# Altium project EPS.PrjPcb (part 4 of 4)

## Sheet EPS_VBAT_EMI-Filter.SchDoc: VBAT / EMI Filter
size A4; Date: 2015-10-11; Author: Piotr Kuligowski; DocumentNumber: PWSat2-xxx-DW-xxx; Revision: 1-0; SheetNumber: 38; SheetTotal: 51; Model: EM1
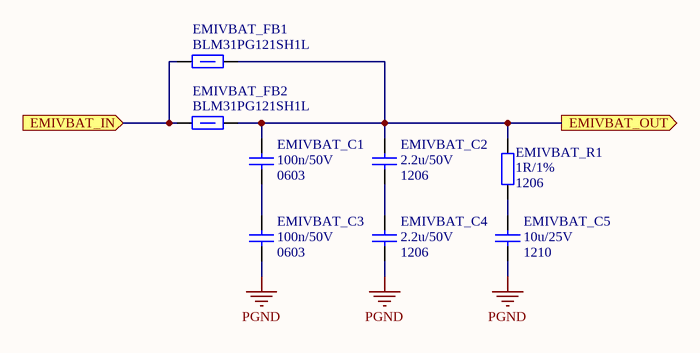
[diagram p36: EPS_VBAT_EMI-Filter.SchDoc]

### Parts
EMIVBAT_C1  Package: 0603  [SMD_Capacitor_0603]  (hidden comment: 100n/50V)
EMIVBAT_C2  Package: 1206  [SMD_Capacitor_1206]  (hidden comment: 2.2u/50V)
EMIVBAT_C3  Package: 0603  [SMD_Capacitor_0603]  (hidden comment: 100n/50V)
EMIVBAT_C4  Package: 1206  [SMD_Capacitor_1206]  (hidden comment: 2.2u/50V)
EMIVBAT_C5  Package: 1210  [SMD_Capacitor_1210]  (hidden comment: 10u/25V)
EMIVBAT_FB1  120R/100MHz  [SMD_FerriteBead_1206]  (value not drawn)
EMIVBAT_FB2  120R/100MHz  [SMD_FerriteBead_1206]  (value not drawn)
EMIVBAT_R1  Package: 1206  [SMD_Resistor_1206]  (hidden comment: 1R/1%)

### Ports
EMIVBAT_IN (in), EMIVBAT_OUT (out)

### Nets
PGND: EMIVBAT_C3.2 EMIVBAT_C4.2 EMIVBAT_C5.2
NetEMIVBAT_C1_1: EMIVBAT_C1.1 EMIVBAT_C2.1 EMIVBAT_FB1.1 EMIVBAT_FB2.1 EMIVBAT_R1.1 ; port EMIVBAT_OUT
NetEMIVBAT_C1_2: EMIVBAT_C1.2 EMIVBAT_C3.1
NetEMIVBAT_C2_2: EMIVBAT_C2.2 EMIVBAT_C4.1
NetEMIVBAT_C5_1: EMIVBAT_C5.1 EMIVBAT_R1.2
NetEMIVBAT_FB1_2: EMIVBAT_FB1.2 EMIVBAT_FB2.2 ; port EMIVBAT_IN

### Notes on the sheet
- Title:
- Project:
- Author:
- Model:
- Document Number:
- Checked by:
- Rev:
- Date:
- Approved by:
- Sheet:
- of
- File name:

### Library data of the parts
EMIVBAT_C1 EMIVBAT_C3 = Cer_C0603T104K5RALTU: Ceramic Cap Kemet COTS 100n/50V X7R 0603; Manufacturer: Kemet; ManufacturerPartNumber: C0603T104K5RALTU; Value: 100n/50V
EMIVBAT_C2 EMIVBAT_C4 = Cer_GCJ31CR71H225KA12L: Ceramic Cap Murata Automotive 2.2u/50V X7R 1206; Manufacturer: Murata; ManufacturerPartNumber: GCJ31CR71H225KA12L; Value: 2.2u/50V
EMIVBAT_C5 = Cer_GCJ32ER71E106KA12L: Ceramic Cap Murata Automotive 10u/25V X7R 1210; Manufacturer: Murata; ManufacturerPartNumber: GCJ32ER71E106KA12L; Value: 10u/25V
EMIVBAT_FB1 EMIVBAT_FB2 = BLM31PG121SH1L: Ferrite bead, 1206, 0.02HM, 3.5A.; Manufacturer: Murata; Current Rating: 3.5A; Series Resistance DC: 0.02R; Package: 1206; Value: 120R/100MHz; ManufacturerPartNumber: BLM31PG121SH1L
EMIVBAT_R1 = CRCW12061R00FKxxxx: 1R/1% Vishay CRCW 1206 Resistor. 250mW, 100ppm, 200V.; ManufacturerPartNumber: CRCW12061R00FKxxxx; Manufacturer: Vishay; Value: 1R/1%

## Sheet EPS_Battery_Controller_Diode.SchDoc: Battery / Controller / Ideal Diode
size A4; ApprovedBy: (not approved); CheckedBy: (not checked); Author: Piotr Kuligowski; DocumentNumber: PWSat2-xxx-DW-xxx; Revision: 2; SheetNumber: 27; SheetTotal: 51; Model: EM2
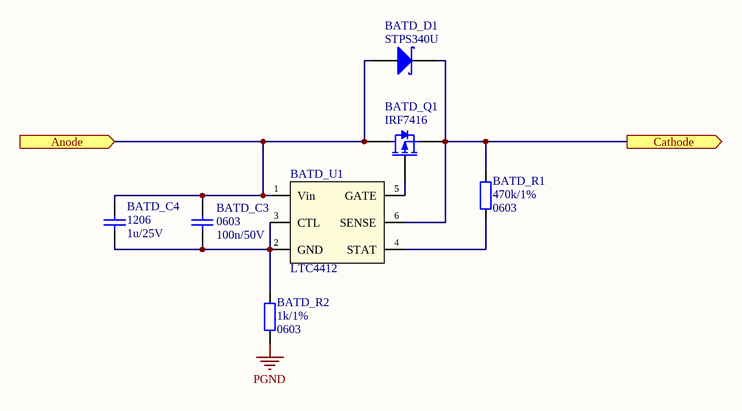
[diagram p37: EPS_Battery_Controller_Diode.SchDoc]

### Parts
BATD_C3  Package: 0603  [SMD_Capacitor_0603]  (hidden comment: 100n/50V)
BATD_C4  Package: 1206  [SMD_Capacitor_1206]  (hidden comment: 1u/25V)
BATD_D1  STPS340U  [DO-214AA]
BATD_Q1  IRF7416  [SOIC-8-N_SSSGDDDD]
BATD_R1  Package: 0603  [SMD_Resistor_0603]  (hidden comment: 470k/1%)
BATD_R2  Package: 0603  [SMD_Resistor_0603]  (hidden comment: 1k/1%)
BATD_U1  LTC4412  [SOT23-6]

### Ports
Anode (in), Cathode (out)

### Nets
PGND: BATD_R2.2
NetBATD_C3_1: BATD_C3.1 BATD_C4.1 BATD_D1.A BATD_Q1.D BATD_U1.1(Vin) ; port Anode
NetBATD_C3_2: BATD_C3.2 BATD_C4.2 BATD_R2.1 BATD_U1.2(GND) BATD_U1.3(CTL)
NetBATD_D1_K: BATD_D1.K BATD_Q1.S BATD_R1.1 BATD_U1.6(SENSE) ; port Cathode
NetBATD_Q1_G: BATD_Q1.G BATD_U1.5(GATE)
NetBATD_R1_2: BATD_R1.2 BATD_U1.4(STAT)

### Notes on the sheet
- Title:
- Project:
- Author:
- Model:
- Document Number:
- Checked by:
- Rev:
- Date:
- Approved by:
- Sheet:
- of
- File name:

### Library data of the parts
BATD_C3 = Cer_GCJ188R71H104KA12D: Ceramic Cap Murata Automotive 100n/50V X7R 0603; Manufacturer: Murata; ManufacturerPartNumber: GCJ188R71H104KA12D; Value: 100n/50V
BATD_C4 = Cer_C1206T105K3RALTU: Ceramic Cap Kemet COTS 1u/25V X7R 1206; ManufacturerPartNumber: C1206T105K3RALTU; Manufacturer: Kemet; Value: 1u/25V
BATD_D1 = STPS340x: 3A/40V Power Schottky Rectifier.; Manufacturer: STMicroelectronics; Value: STPS340U
BATD_Q1 = IRF7416: 10A/30V HEXFET Power P-MOSFET.; Manufacturer: International Rectifier; Value: IRF7416
BATD_R1 BATD_R2 = Res
  BATD_R1: Value: 470k/1%
  BATD_R2: Value: 1k/1%
BATD_U1 = LTC4412: Ideal Diode, Low Loss PowerPath Controller.; Manufacturer: Linear Technology; Value: LTC4412

## Sheet EPS_Battery_Controller_RLCL.SchDoc: Battery / Controller / RLCL
size A4; ApprovedBy: (not approved); CheckedBy: (not checked); Author: Piotr Kuligowski; DocumentNumber: PWSat2-xxx-DW-xxx; Revision: 2; SheetNumber: 28; SheetTotal: 51; Model: EM2
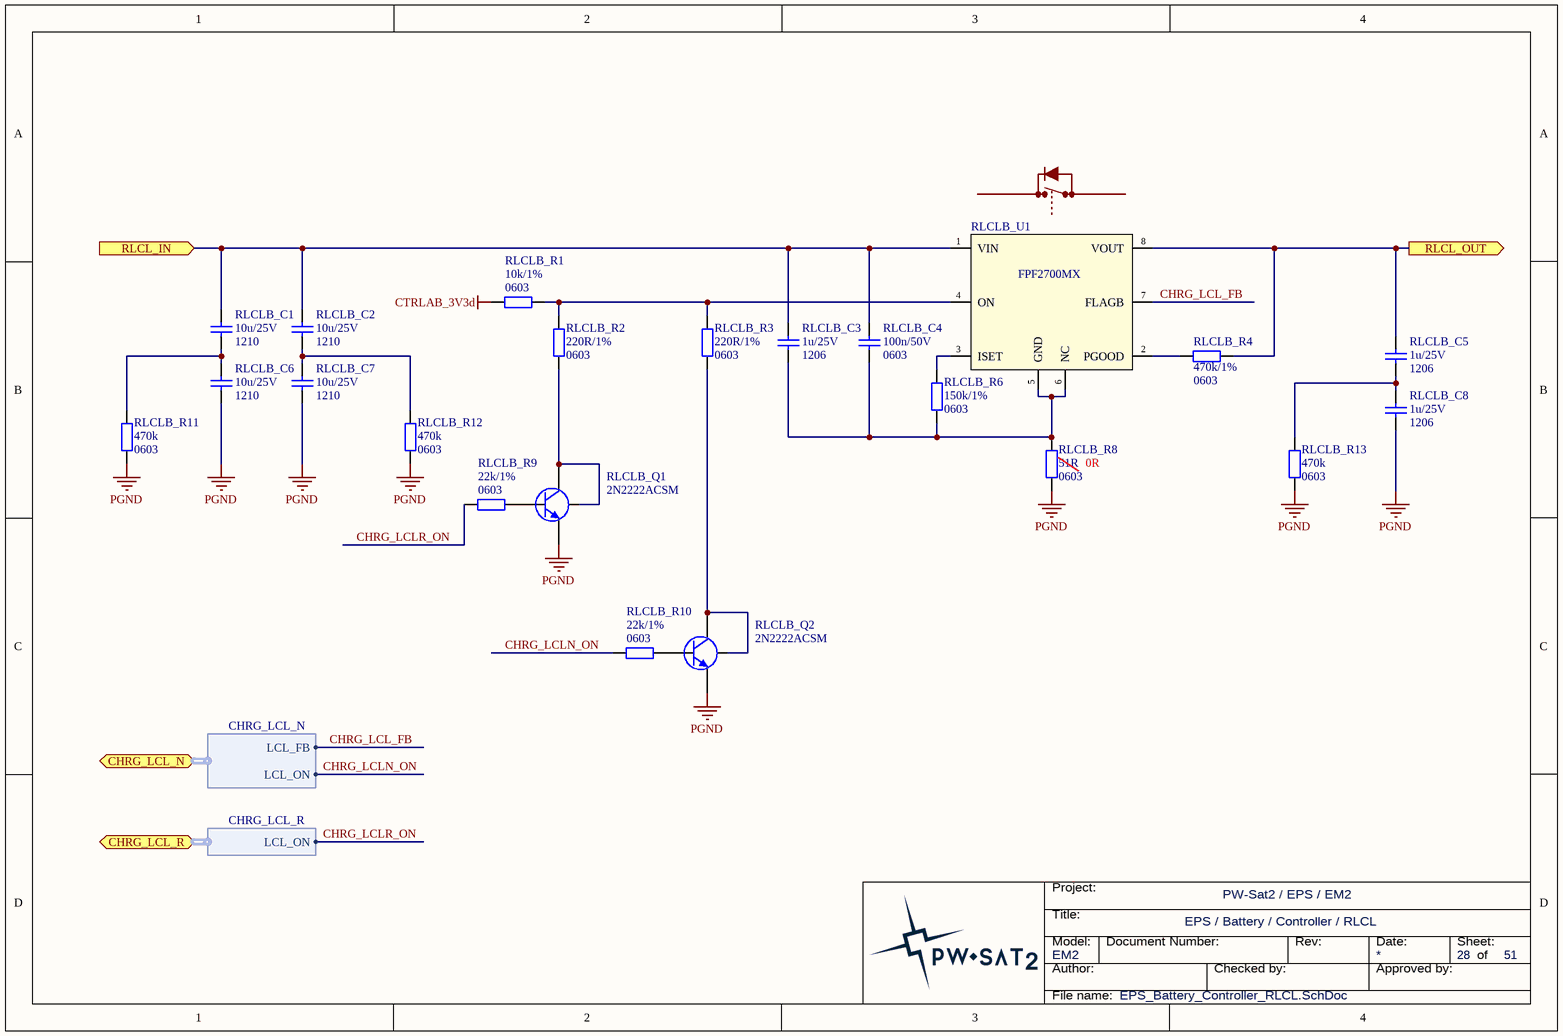
[diagram p38: EPS_Battery_Controller_RLCL.SchDoc]

### Parts
RLCLB_C1  Package: 1210  [SMD_Capacitor_1210]  (hidden comment: 10u/25V)
RLCLB_C2  Package: 1210  [SMD_Capacitor_1210]  (hidden comment: 10u/25V)
RLCLB_C3  Package: 1206  [SMD_Capacitor_1206]  (hidden comment: 1u/25V)
RLCLB_C4  Package: 0603  [SMD_Capacitor_0603]  (hidden comment: 100n/50V)
RLCLB_C5  Package: 1206  [SMD_Capacitor_1206]  (hidden comment: 1u/25V)
RLCLB_C6  Package: 1210  [SMD_Capacitor_1210]  (hidden comment: 10u/25V)
RLCLB_C7  Package: 1210  [SMD_Capacitor_1210]  (hidden comment: 10u/25V)
RLCLB_C8  Package: 1206  [SMD_Capacitor_1206]  (hidden comment: 1u/25V)
RLCLB_Q1  2N2222ACSM  [LCC1-4_BEC]
RLCLB_Q2  2N2222ACSM  [LCC1-4_BEC]
RLCLB_R1  Package: 0603  [SMD_Resistor_0603]  (hidden comment: 10k/1%)
RLCLB_R2  Package: 0603  [SMD_Resistor_0603]  (hidden comment: 220R/1%)
RLCLB_R3  Package: 0603  [SMD_Resistor_0603]  (hidden comment: 220R/1%)
RLCLB_R4  Package: 0603  [SMD_Resistor_0603]  (hidden comment: 470k/1%)
RLCLB_R6  Package: 0603  [SMD_Resistor_0603]  (hidden comment: 150k/1%)
RLCLB_R8  Package: 0603  [SMD_Resistor_0603]  (hidden comment: 51R)
RLCLB_R9  Package: 0603  [SMD_Resistor_0603]  (hidden comment: 22k/1%)
RLCLB_R10  Package: 0603  [SMD_Resistor_0603]  (hidden comment: 22k/1%)
RLCLB_R11  Package: 0603  [SMD_Resistor_0603]  (hidden comment: 470k)
RLCLB_R12  Package: 0603  [SMD_Resistor_0603]  (hidden comment: 470k)
RLCLB_R13  Package: 0603  [SMD_Resistor_0603]  (hidden comment: 470k)
RLCLB_U1  FPF2700MX  [SOIC-8-N]

### Ports
CHRG_LCL_N (harness CHRG_LCL_N), CHRG_LCL_R (harness CHRG_LCL_R), RLCL_IN (in), RLCL_OUT (out)

### Harnesses
CHRG_LCL_N: LCL_FB, LCL_ON
CHRG_LCL_R: LCL_ON

### Nets
CTRLAB_3V3d: RLCLB_R1.2
PGND: RLCLB_C6.2 RLCLB_C7.2 RLCLB_C8.2 RLCLB_Q1.E RLCLB_Q2.E RLCLB_R8.2 RLCLB_R11.2 RLCLB_R12.2 RLCLB_R13.2
CHRG_LCL_FB: RLCLB_U1.7(FLAGB) ; port CHRG_LCL_N.LCL_FB
CHRG_LCLN_ON: RLCLB_R10.1 ; port CHRG_LCL_N.LCL_ON
CHRG_LCLR_ON: RLCLB_R9.1 ; port CHRG_LCL_R.LCL_ON
NetRLCLB_C1_1: RLCLB_C1.1 RLCLB_C2.1 RLCLB_C3.1 RLCLB_C4.1 RLCLB_U1.1(VIN) ; port RLCL_IN
NetRLCLB_C1_2: RLCLB_C1.2 RLCLB_C6.1 RLCLB_R11.1
NetRLCLB_C2_2: RLCLB_C2.2 RLCLB_C7.1 RLCLB_R12.1
NetRLCLB_C3_2: RLCLB_C3.2 RLCLB_C4.2 RLCLB_R6.2 RLCLB_R8.1 RLCLB_U1.5(GND) RLCLB_U1.6(NC)
NetRLCLB_C5_1: RLCLB_C5.1 RLCLB_R4.2 RLCLB_U1.8(VOUT) ; port RLCL_OUT
NetRLCLB_C5_2: RLCLB_C5.2 RLCLB_C8.1 RLCLB_R13.1
NetRLCLB_Q1_B: RLCLB_Q1.B RLCLB_R9.2
NetRLCLB_Q1_C: RLCLB_Q1.C RLCLB_Q1.Shield RLCLB_R2.2
NetRLCLB_Q2_B: RLCLB_Q2.B RLCLB_R10.2
NetRLCLB_Q2_C: RLCLB_Q2.C RLCLB_Q2.Shield RLCLB_R3.2
NetRLCLB_R1_1: RLCLB_R1.1 RLCLB_R2.1 RLCLB_R3.1 RLCLB_U1.4(ON)
NetRLCLB_R4_1: RLCLB_R4.1 RLCLB_U1.2(PGOOD)
NetRLCLB_R6_1: RLCLB_R6.1 RLCLB_U1.3(ISET)

### Notes on the sheet
- (near RLCLB_R8) 0R
- Title:
- Project:
- Author:
- Model:
- Document Number:
- Checked by:
- Rev:
- Date:
- Approved by:
- Sheet:
- of
- File name:

### Library data of the parts
RLCLB_C1 RLCLB_C2 RLCLB_C6 RLCLB_C7 = Cer_GCJ32ER71E106KA12L: as EMIVBAT_C5 on sheet EPS_VBAT_EMI-Filter; Manufacturer: Murata; ManufacturerPartNumber: GCJ32ER71E106KA12L; Value: 10u/25V
RLCLB_C3 RLCLB_C5 RLCLB_C8 = Cer_C1206T105K3RALTU: Ceramic Cap Kemet COTS 1u/25V X7R 1206; ManufacturerPartNumber: C1206T105K3RALTU; Manufacturer: Kemet; Value: 1u/25V
RLCLB_C4 = Cer_GCJ188R71H104KA12D: as BATD_C3 on sheet EPS_Battery_Controller_Diode; Manufacturer: Murata; ManufacturerPartNumber: GCJ188R71H104KA12D; Value: 100n/50V
RLCLB_Q1 RLCLB_Q2 = 2N2222ACSM: Silicon Planar Epitaxial NPN Transistor.; Manufacturer: Semelab-TT; Value: 2N2222ACSM
RLCLB_R1-RLCLB_R4 RLCLB_R6 RLCLB_R8-RLCLB_R13 = Res
  RLCLB_R1: Value: 10k/1%
  RLCLB_R2 RLCLB_R3: Value: 220R/1%
  RLCLB_R4: Value: 470k/1%
  RLCLB_R6: Value: 150k/1%
  RLCLB_R8: Value: 51R
  RLCLB_R9 RLCLB_R10: Value: 22k/1%
  RLCLB_R11-RLCLB_R13: Value: 470k
RLCLB_U1 = FPF2700MX: Adj over-current protection 0.4-2A, Load Switch; Manufacturer: Fairchild Semiconductor; Value: FPF2700MX

## Nets that join several sheets
AGND: Top/MPPT X/MPPTX Interface to uC (18 pins), Top/MPPT Y+/MPPTY Interface to uC (18 pins), Top/MPPT Y-/MPPTY Interface to uC (18 pins)
CTRLA_3V3a: EPS_CTRL_A (8 pins), Top/Controller A/CTRL-A_Supply (CTRL_FB1_1.1 CTRL_FB2_1.1), Top/MPPT X/MPPTX Measurements (MEAS_R3_1.1), Top/MPPT Y+/MPPTY Measurements (MEAS_R3_2.1), Top/Local-Supply and WDTs/Local-Supply CTRL-A (LS_FB1_1.2 SUPP_C1_1.1 SUPP_C2_1.1 TEMP_R5_1.2), Top/MPPT Y-/MPPTY Measurements (MEAS_R3_3.1), EPS_Distribution_Measurements (HK_R2.1)
CTRLA_3V3d: EPS_Battery_Controller_Current-Meas (BATC_R3.1 BATC_R4.1), EPS_CTRL_A (20 pins), Top/Controller A/I2C Repeater (7 pins), Top/Controller A/CTRL-A_Supply (CTRL_C1_1.1 CTRL_C2_1.1 CTRL_C8_1.1 CTRL_C9_1.1), EPS_DCDC_RLCLs (SEL_C2.1 SEL_R10.2 SEL_U1.5), Top/LCLs for DCDC/DCDC RLCL (DRLCL_R3_1.2), Top/LCLs for DCDC/VBAT RLCL (DRLCL_R3_2.2), EPS_Local-Supply (LS_D1.A LS_R9.2), Top/Local-Supply and WDTs/Local-Supply CTRL-A (SUPP_C5_1.1 SUPP_C6_1.1 SUPP_R2_1.1 SUPP_U3_1.6), EPS_CTRL_B (CTRLB_R3.2), EPS_Battery_Heaters-Control (HTR_R1.2)
CTRLAB_3V3d: EPS_DCDC_RLCLs (SEL_R1.2), EPS_Local-Supply (LS_R7.2 LS_R8.1 LS_R10.2), EPS_Distribution_LCL-FPF (LCL_R2.1), EPS_Distribution_LCL-TK (LCLTK_R6.1), EPS_Battery_Controller_RLCL (RLCLB_R1.2)
CTRLB_3V3a: Top/Local-Supply and WDTs/Local-Supply CTRL-B (LS_FB1_2.2 SUPP_C1_2.1 SUPP_C2_2.1 TEMP_R5_2.2), EPS_CTRL_B (CTRLB_R10.2), Top/Controller B/CTRL-B_Supply (CTRL_FB1_2.1 CTRL_FB2_2.1)
CTRLB_3V3d: EPS_CTRL_A (CTRLA_R14.2), EPS_DCDC_RLCLs (SEL_C3.1 SEL_R11.2 SEL_U2.5), EPS_Local-Supply (LS_D2.A LS_R11.2), Top/Local-Supply and WDTs/Local-Supply CTRL-B (SUPP_C5_2.1 SUPP_C6_2.1 SUPP_R2_2.1 SUPP_U3_2.6), EPS_CTRL_B (13 pins), Top/Controller B/I2C Repeater (7 pins), Top/Controller B/CTRL-B_Supply (CTRL_C1_2.1 CTRL_C2_2.1 CTRL_C8_2.1 CTRL_C9_2.1)
CTRLB_Vref: EPS_CTRL_B (CTRLB_R9.2 CTRLB_U1.29), Top/Controller B/CTRL-B_Supply (CTRL_C5_2.1 CTRL_C6_2.1 CTRL_R1_2.1 CTRL_REF1_2.1)
DGND: EPS_CTRL_A (21 pins), Top/Controller A/I2C Repeater (5 pins), Top/Controller A/CTRL-A_Supply (12 pins), Top/Controller A/Temperature-Sensor (TEMP_C1_1.2 TEMP_U1_1.2), EPS_Local-Supply (LS_R9.1 LS_R10.1 LS_R11.1), EPS_CTRL_B (14 pins), Top/Controller B/I2C Repeater (5 pins), Top/Controller B/Temperature-Sensor (TEMP_C1_4.2 TEMP_U1_4.2), Top/Controller B/CTRL-B_Supply (12 pins), EPS_Distribution_Measurements (HK_C4.2)
PGND: EPS_3V3_EMI-Filter_In (EMIAA_C2.2 EMIAA_C3.2), EPS_3V3_EMI-Filter_Out (EMIAB_C2.2 EMIAB_C3.2 EMIAB_C4.2), EPS_5V_EMI-Filter_In (EMIBA_C2.2 EMIBA_C3.2), EPS_Battery_Controller_Current-Meas (BATC_R2.2 BATC_R5.1), EPS_5V_Buck-Converter (17 pins), EPS_3V3_Buck-Converter (17 pins), EPS_Connectors (13 pins), Top/Controller A/CTRL-A_Supply (CTRL_J1_1.1), EPS_MPPT_X_Boost-Converter (13 pins), EPS_MPPT_X_OR_Solar (8 pins), EPS_MPPT_X_EMI-Filter_Solar-Panels (5 pins), Top/MPPT X/MPPTX Interface to uC (MPPT_C10_1.2 MPPT_J1_1.1 MPPT_U4_1.2), Top/MPPT X/MPPTX Measurements (5 pins), EPS_MPPT_X_EMI-Filter_Out (EMIXO_C1.2 EMIXO_C2.2 EMIXO_C3.2), EPS_MPPT_X_OR_MPB (SUMPBX_C4.2 SUMPBX_R4.2 SUMPBX_R6.2), Top/MPPT Y+/MPPTY Buck-Boost Converter (20 pins), Top/MPPT Y+/MPPTY Solar Panels ORing (8 pins), Top/MPPT Y+/MPPTY Interface to uC (MPPT_C10_2.2 MPPT_J1_2.1 MPPT_U4_2.2), Top/MPPT Y+/MPPTY Measurements (5 pins), Top/MPPT Y+/MPPTY ORing to MPB (5 pins), EPS_RBL (RBL_C2.2 RBL_C4.2 RBL_Q2.E RBL_Q4.E), EPS_DCDC_RLCLs (13 pins), Top/LCLs for DCDC/DCDC RLCL (DRLCL_C4_1.2 DRLCL_C5_1.2 DRLCL_R4_1.1 DRLCL_R5_1.2), Top/LCLs for DCDC/VBAT RLCL (DRLCL_C4_2.2 DRLCL_C5_2.2 DRLCL_R4_2.1 DRLCL_R5_2.2), EPS_Local-Supply (LS_C2.2 LS_R4.2), Top/Local-Supply and WDTs/Local-Supply CTRL-A (17 pins), Top/Local-Supply and WDTs/Local-Supply CTRL-A/Temperature-Sensor (TEMP_C1_2.2 TEMP_U1_2.2), Top/Local-Supply and WDTs/Local-Supply CTRL-B (17 pins), Top/Local-Supply and WDTs/Local-Supply CTRL-B/Temperature-Sensor (TEMP_C1_3.2 TEMP_U1_3.2), Top/MPPT Y-/MPPTY Buck-Boost Converter (20 pins), Top/MPPT Y-/MPPTY Solar Panels ORing (8 pins), Top/MPPT Y-/MPPTY Interface to uC (MPPT_C10_3.2 MPPT_J1_3.1 MPPT_U4_3.2), Top/MPPT Y-/MPPTY Measurements (5 pins), Top/MPPT Y-/MPPTY ORing to MPB (5 pins), EPS_CTRL_B (CTRLB_C5.2 CTRLB_J1.1), Top/Controller B/CTRL-B_Supply (CTRL_J1_2.1), EPS_Connectors_PC-104 (6 pins), EPS_Distribution_LCL-FPF (LCL_C2.2 LCL_C3.2 LCL_R3.1 LCL_R5.1), EPS_Distribution_LCL-TK (10 pins), EPS_Distribution_RLCL-FPF (6 pins), EPS_Battery_Heaters-Control (HTR_Q2.E HTR_Q3.S HTR_R3.1 HTR_R7.1), EPS_Distribution_Measurements (5 pins), EPS_VBAT_EMI-Filter (EMIVBAT_C3.2 EMIVBAT_C4.2 EMIVBAT_C5.2), EPS_Battery_Controller_Diode (BATD_R2.2), EPS_Battery_Controller_RLCL (9 pins)
CTRLA_HK_SUPP_TEMP: EPS_CTRL_A (CTRLA_U3.7), Top/Local-Supply and WDTs/Local-Supply CTRL-A/Temperature-Sensor (TEMP_R1_2.2)
CTRLA_HK_TEMP: EPS_CTRL_A (CTRLA_U3.5), Top/Controller A/Temperature-Sensor (TEMP_R1_1.2)
CTRLB_HK_SUPP_TEMP: Top/Local-Supply and WDTs/Local-Supply CTRL-B/Temperature-Sensor (TEMP_R1_3.2), EPS_CTRL_B (CTRLB_U1.34)
CTRLB_HK_TEMP: EPS_CTRL_B (CTRLB_U1.37), Top/Controller B/Temperature-Sensor (TEMP_R1_4.2)
MPPT_3V3a: EPS_CTRL_A (CTRLA_J1.1), Top/MPPT X/MPPTX Interface to uC (12 pins)
MPPT_3V3a: EPS_CTRL_A (CTRLA_J2.1), Top/MPPT Y+/MPPTY Interface to uC (12 pins)
MPPT_3V3a: EPS_CTRL_A (CTRLA_J4.1), Top/MPPT Y-/MPPTY Interface to uC (12 pins)
MPPT_CS_ADC: EPS_CTRL_A (CTRLA_R1.1), Top/MPPT X/MPPTX Interface to uC (MPPT_U3_1.1)
MPPT_CS_ADC: EPS_CTRL_A (CTRLA_R11.2), Top/MPPT Y+/MPPTY Interface to uC (MPPT_U3_2.1)
MPPT_CS_ADC: EPS_CTRL_A (CTRLA_R24.2), Top/MPPT Y-/MPPTY Interface to uC (MPPT_U3_3.1)
MPPT_CS_DAC: EPS_CTRL_A (CTRLA_R1.2), Top/MPPT X/MPPTX Interface to uC (MPPT_U2_1.6)
MPPT_CS_DAC: EPS_CTRL_A (CTRLA_R11.4), Top/MPPT Y+/MPPTY Interface to uC (MPPT_U2_2.6)
MPPT_CS_DAC: EPS_CTRL_A (CTRLA_R24.1), Top/MPPT Y-/MPPTY Interface to uC (MPPT_U2_3.6)
MPPT_DIN: EPS_CTRL_A (CTRLA_R1.3), Top/MPPT X/MPPTX Interface to uC (MPPT_U2_1.4 MPPT_U3_1.8)
MPPT_DIN: EPS_CTRL_A (CTRLA_R11.3), Top/MPPT Y+/MPPTY Interface to uC (MPPT_U2_2.4 MPPT_U3_2.8)
MPPT_DIN: EPS_CTRL_A (CTRLA_R24.4), Top/MPPT Y-/MPPTY Interface to uC (MPPT_U2_3.4 MPPT_U3_3.8)
MPPT_DOUT: EPS_CTRL_A (CTRLA_R1.4), Top/MPPT X/MPPTX Interface to uC (MPPT_U3_1.9)
MPPT_DOUT: EPS_CTRL_A (CTRLA_R11.1), Top/MPPT Y+/MPPTY Interface to uC (MPPT_U3_2.9)
MPPT_DOUT: EPS_CTRL_A (CTRLA_R24.3), Top/MPPT Y-/MPPTY Interface to uC (MPPT_U3_3.9)
MPPT_Meas_I: Top/MPPT X/MPPTX Interface to uC (MPPT_R10_1.2), Top/MPPT X/MPPTX Measurements (MEAS_U1_1.2)
MPPT_Meas_I: Top/MPPT Y+/MPPTY Interface to uC (MPPT_R10_2.2), Top/MPPT Y+/MPPTY Measurements (MEAS_U1_2.2)
MPPT_Meas_I: Top/MPPT Y-/MPPTY Interface to uC (MPPT_R10_3.2), Top/MPPT Y-/MPPTY Measurements (MEAS_U1_3.2)
MPPT_Meas_V: Top/MPPT X/MPPTX Interface to uC (MPPT_R1_1.2 MPPT_U3_1.6), Top/MPPT X/MPPTX Measurements (MEAS_C1_1.1 MEAS_R2_1.2 MEAS_R4_1.1)
MPPT_Meas_V: Top/MPPT Y+/MPPTY Interface to uC (MPPT_R1_2.2 MPPT_U3_2.6), Top/MPPT Y+/MPPTY Measurements (MEAS_C1_2.1 MEAS_R2_2.2 MEAS_R4_2.1)
MPPT_Meas_V: Top/MPPT Y-/MPPTY Interface to uC (MPPT_R1_3.2 MPPT_U3_3.6), Top/MPPT Y-/MPPTY Measurements (MEAS_C1_3.1 MEAS_R2_3.2 MEAS_R4_3.1)
MPPT_SCLK: EPS_CTRL_A (CTRLA_R4.2), Top/MPPT X/MPPTX Interface to uC (MPPT_U2_1.5 MPPT_U3_1.10)
MPPT_SCLK: EPS_CTRL_A (CTRLA_R13.2), Top/MPPT Y+/MPPTY Interface to uC (MPPT_U2_2.5 MPPT_U3_2.10)
MPPT_SCLK: EPS_CTRL_A (CTRLA_R25.2), Top/MPPT Y-/MPPTY Interface to uC (MPPT_U2_3.5 MPPT_U3_3.10)
NetCTRL_C3_1_1: EPS_CTRL_A (CTRLA_U4.64), Top/Controller A/CTRL-A_Supply (CTRL_C3_1.1 CTRL_C4_1.1 CTRL_FB1_1.2)
NetCTRL_C3_2_1: EPS_CTRL_B (CTRLB_U1.27), Top/Controller B/CTRL-B_Supply (CTRL_C3_2.1 CTRL_C4_2.1 CTRL_FB1_2.2)
NetCTRL_C5_1_1: EPS_CTRL_A (CTRLA_U4.62), Top/Controller A/CTRL-A_Supply (CTRL_C5_1.1 CTRL_C6_1.1 CTRL_R1_1.1 CTRL_REF1_1.1)
NetCTRLA_R21_1: EPS_CTRL_A (CTRLA_R21.1), Top/Controller A/Temperature-Sensor (TEMP_C1_1.1 TEMP_U1_1.1 TEMP_U1_1.4 TEMP_U1_1.5)
NetCTRLA_U4_6: EPS_CTRL_A (CTRLA_U4.6), Top/Controller A/I2C Repeater (RPT_R3_1.2)
NetCTRLA_U4_7: EPS_CTRL_A (CTRLA_U4.7), Top/Controller A/I2C Repeater (RPT_R5_1.2)
NetCTRLA_U4_14: EPS_CTRL_A (CTRLA_U4.14), EPS_DCDC_RLCLs (SEL_R4.1)
NetCTRLA_U4_15: EPS_CTRL_A (CTRLA_U4.15), EPS_DCDC_RLCLs (SEL_R6.2)
NetCTRLA_U4_17: EPS_CTRL_A (CTRLA_U4.17), Top/Local-Supply and WDTs/Local-Supply CTRL-A (SUPP_R13_1.2)
NetCTRLB_R10_1: EPS_CTRL_B (CTRLB_R10.1), Top/Controller B/Temperature-Sensor (TEMP_C1_4.1 TEMP_U1_4.1 TEMP_U1_4.4 TEMP_U1_4.5)
NetCTRLB_U1_1: Top/MPPT X/MPPTX Interface to uC (MPPT_R16_1.2 MPPT_U5_1.5), EPS_CTRL_B (CTRLB_U1.1)
NetCTRLB_U1_2: Top/MPPT Y+/MPPTY Interface to uC (MPPT_R16_2.2 MPPT_U5_2.5), EPS_CTRL_B (CTRLB_U1.2)
NetCTRLB_U1_3: Top/MPPT Y-/MPPTY Interface to uC (MPPT_R16_3.2 MPPT_U5_3.5), EPS_CTRL_B (CTRLB_U1.3)
NetCTRLB_U1_13: EPS_DCDC_RLCLs (SEL_R5.1), EPS_CTRL_B (CTRLB_U1.13)
NetCTRLB_U1_14: EPS_DCDC_RLCLs (SEL_R7.2), EPS_CTRL_B (CTRLB_U1.14)
NetCTRLB_U1_19: EPS_CTRL_B (CTRLB_U1.19), Top/Controller B/I2C Repeater (RPT_R3_2.2)
NetCTRLB_U1_20: EPS_CTRL_B (CTRLB_U1.20), Top/Controller B/I2C Repeater (RPT_R5_2.2)
NetCTRLB_U1_42: Top/Local-Supply and WDTs/Local-Supply CTRL-B (SUPP_R13_2.2), EPS_CTRL_B (CTRLB_U1.42)
NetDCDCX_C2_2: EPS_MPPT_X_Boost-Converter (5 pins), EPS_MPPT_X_EMI-Filter_Out (EMIXO_FB1.2)
NetDCDCX_R7_2: EPS_MPPT_X_Boost-Converter (DCDCX_R7.2), Top/MPPT X/MPPTX Interface to uC (MPPT_C4_1.2 MPPT_R4_1.1 MPPT_U1_1.1)
NetDCDCY_R7_1_1: Top/MPPT Y+/MPPTY Buck-Boost Converter (DCDCY_R7_1.1), Top/MPPT Y+/MPPTY Interface to uC (MPPT_C4_2.2 MPPT_R4_2.1 MPPT_U1_2.1)
NetDCDCY_R7_2_1: Top/MPPT Y-/MPPTY Buck-Boost Converter (DCDCY_R7_2.1), Top/MPPT Y-/MPPTY Interface to uC (MPPT_C4_3.2 MPPT_R4_3.1 MPPT_U1_3.1)
NetDRLCL_C1_1_1: EPS_RBL (RBL_Q1.D RBL_Q3.D), Top/LCLs for DCDC/DCDC RLCL (DRLCL_C1_1.1 DRLCL_C2_1.1 DRLCL_C3_1.1 DRLCL_U1_1.1), Top/LCLs for DCDC/VBAT RLCL (DRLCL_C1_2.1 DRLCL_C2_2.1 DRLCL_C3_2.1 DRLCL_U1_2.1), EPS_Local-Supply (LS_FB1.1 LS_FB2.1)
NetDRLCL_U1_1_4: EPS_DCDC_RLCLs (6 pins), Top/LCLs for DCDC/DCDC RLCL (DRLCL_U1_1.4), Top/LCLs for DCDC/VBAT RLCL (DRLCL_U1_2.4)
NetEMIXO_C1_1: Top/MPPT X/MPPTX Interface to uC (MPPT_R13_1.2), EPS_MPPT_X_EMI-Filter_Out (EMIXO_C1.1 EMIXO_C2.1 EMIXO_FB1.1 EMIXO_R1.2), EPS_MPPT_X_OR_MPB (5 pins)
NetEMIXS_C1_1: EPS_MPPT_X_OR_Solar (SUMX_D1.A SUMX_R3.1), EPS_MPPT_X_EMI-Filter_Solar-Panels (EMIXS_C1.1 EMIXS_FB1.1)
NetEMIXS_C2_1: EPS_MPPT_X_OR_Solar (SUMX_C2.1 SUMX_C3.1 SUMX_D1.K SUMX_U1.1), EPS_MPPT_X_EMI-Filter_Solar-Panels (EMIXS_C2.1 EMIXS_C3.1 EMIXS_FB2.1 EMIXS_FB3.1)
NetEMIXS_T1_1: EPS_Connectors (H6.3 H6.7), EPS_MPPT_X_EMI-Filter_Solar-Panels (EMIXS_T1.1)
NetEMIXS_T1_2: EPS_Connectors (H6.4 H6.8), EPS_MPPT_X_EMI-Filter_Solar-Panels (EMIXS_T1.2)
NetEMIXS_T2_1: EPS_Connectors (H7.3 H7.7), EPS_MPPT_X_EMI-Filter_Solar-Panels (EMIXS_T2.1)
NetEMIXS_T2_2: EPS_Connectors (H7.4 H7.8), EPS_MPPT_X_EMI-Filter_Solar-Panels (EMIXS_T2.2)
NetH3_1: EPS_Connectors (H3.1 H4.1), EPS_RBL (8 pins)
NetH3_2: EPS_Connectors (H3.2 H4.2), EPS_MPPT_X_OR_MPB (7 pins), Top/MPPT Y+/MPPTY ORing to MPB (6 pins), Top/MPPT Y-/MPPTY ORing to MPB (6 pins)
NetH5_2: EPS_Connectors (H5.2), EPS_RBL (6 pins)
NetLS_C1_1: EPS_Local-Supply (LS_C1.1 LS_FB1.2 LS_FB2.2 LS_R2.1), Top/Local-Supply and WDTs/Local-Supply CTRL-A (SUPP_C4_1.1 SUPP_U1_1.1 SUPP_U1_1.3), Top/Local-Supply and WDTs/Local-Supply CTRL-B (SUPP_C4_2.1 SUPP_U1_2.1 SUPP_U1_2.3)
NetMEAS_R1_1_1: EPS_MPPT_X_OR_Solar (SUMX_C1.1 SUMX_R1.1 SUMX_R2.1 SUMX_U1.8), Top/MPPT X/MPPTX Measurements (MEAS_R1_1.1 MEAS_R2_1.1)
NetMEAS_R1_2_1: Top/MPPT Y+/MPPTY Solar Panels ORing (SUMY_C1_1.1 SUMY_R1_1.1 SUMY_R2_1.1 SUMY_U1_1.8), Top/MPPT Y+/MPPTY Measurements (MEAS_R1_2.1 MEAS_R2_2.1)
NetMEAS_R1_3_1: Top/MPPT Y-/MPPTY Solar Panels ORing (SUMY_C1_2.1 SUMY_R1_2.1 SUMY_R2_2.1 SUMY_U1_2.8), Top/MPPT Y-/MPPTY Measurements (MEAS_R1_3.1 MEAS_R2_3.1)
NetMPPT_R13_2_2: Top/MPPT Y+/MPPTY Interface to uC (MPPT_R13_2.2), Top/MPPT Y+/MPPTY ORing to MPB (SUMPB_U1_1.1 SUMPBY_C1_1.1 SUMPBY_C2_1.1 SUMPBY_Q1_1.D)
NetMPPT_R13_3_2: Top/MPPT Y-/MPPTY Interface to uC (MPPT_R13_3.2), Top/MPPT Y-/MPPTY ORing to MPB (SUMPB_U1_2.1 SUMPBY_C1_2.1 SUMPBY_C2_2.1 SUMPBY_Q1_2.D)
NetTEMP_C1_2_1: Top/Local-Supply and WDTs/Local-Supply CTRL-A (TEMP_R5_1.1), Top/Local-Supply and WDTs/Local-Supply CTRL-A/Temperature-Sensor (TEMP_C1_2.1 TEMP_U1_2.1 TEMP_U1_2.4 TEMP_U1_2.5)
NetTEMP_C1_3_1: Top/Local-Supply and WDTs/Local-Supply CTRL-B (TEMP_R5_2.1), Top/Local-Supply and WDTs/Local-Supply CTRL-B/Temperature-Sensor (TEMP_C1_3.1 TEMP_U1_3.1 TEMP_U1_3.4 TEMP_U1_3.5)
PC-104_EXTX: EPS_MPPT_X_EMI-Filter_Solar-Panels (EMIXS_FB1.2), EPS_Connectors_PC-104 (H1.13)
PC-104_I2C-Bus_SCL: EPS_Connectors (H8.7), Top/Controller A/I2C Repeater (RPT_R4_1.2), EPS_Connectors_PC-104 (H1.43)
PC-104_I2C-Bus_SDA: EPS_Connectors (H8.2), Top/Controller A/I2C Repeater (RPT_R6_1.2), EPS_Connectors_PC-104 (H1.41)
PC-104_I2C-Payload_SCL: EPS_Connectors (H8.8), Top/Controller B/I2C Repeater (RPT_R4_2.2), EPS_Connectors_PC-104 (H1.21)
PC-104_I2C-Payload_SDA: EPS_Connectors (H8.4), Top/Controller B/I2C Repeater (RPT_R6_2.2), EPS_Connectors_PC-104 (H1.23)